# Altium schematic sheet Navigation.SchDoc
size A
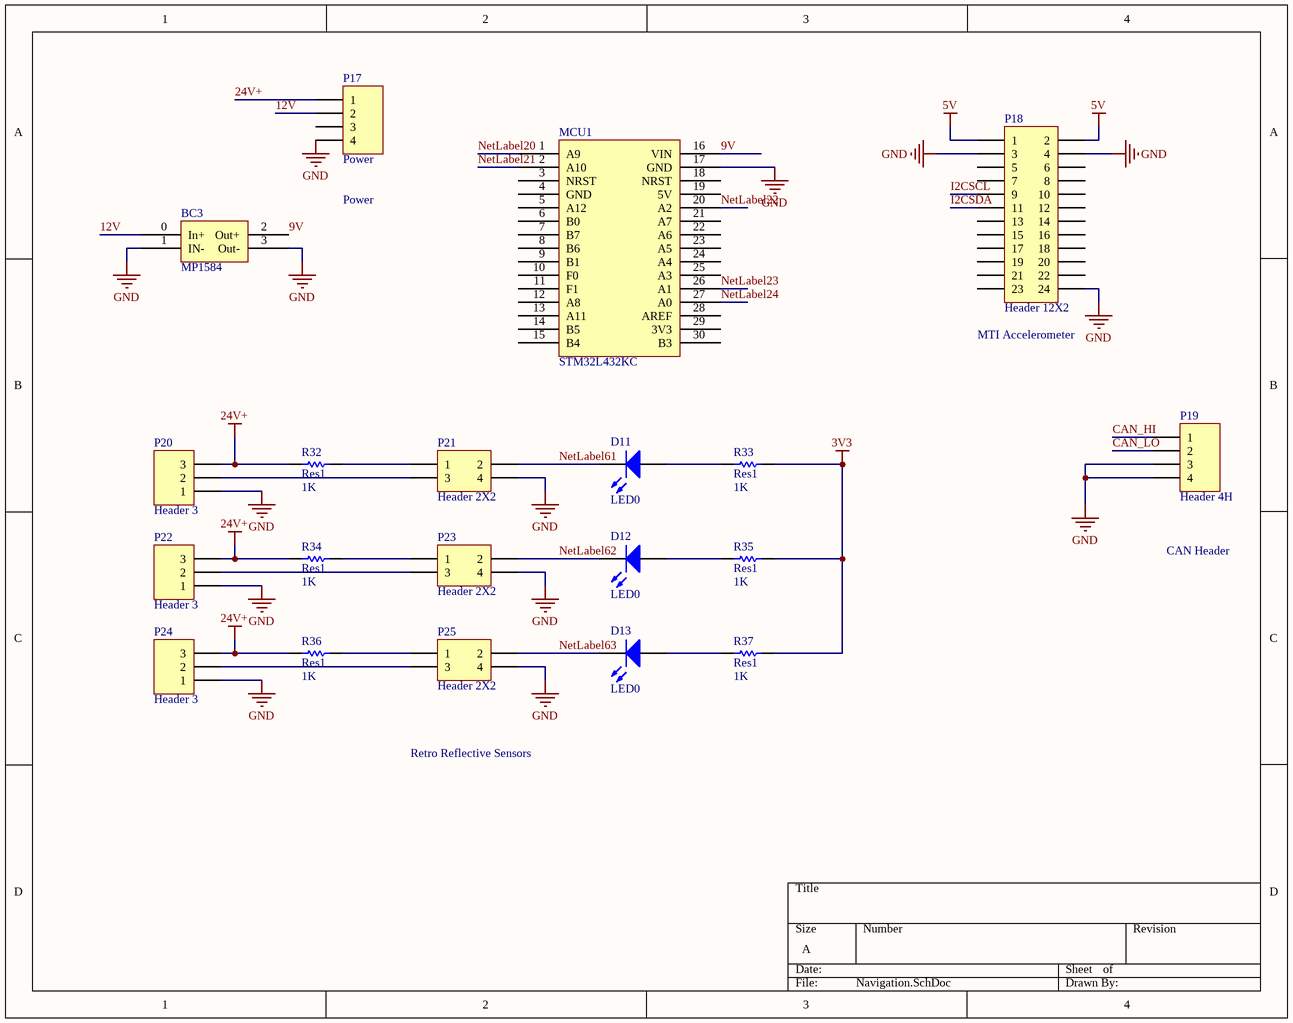
[diagram p0: Navigation.SchDoc]

## Parts
BC3  MP1584
D11  LED0  [LED-0]
D12  LED0  [LED-0]
D13  LED0  [LED-0]
MCU1  STM32L432KC
P17  Power  [HDR1X4]
P18  Header 12X2  [HDR2X12]
P19  Header 4H  [HDR1X4H]
P20  Header 3  [HDR1X3]
P21  Header 2X2  [HDR2X2]
P22  Header 3  [HDR1X3]
P23  Header 2X2  [HDR2X2]
P24  Header 3  [HDR1X3]
P25  Header 2X2  [HDR2X2]
R32  Res1  value 1K  [AXIAL-0.3]
R33  Res1  value 1K  [AXIAL-0.3]
R34  Res1  value 1K  [AXIAL-0.3]
R35  Res1  value 1K  [AXIAL-0.3]
R36  Res1  value 1K  [AXIAL-0.3]
R37  Res1  value 1K  [AXIAL-0.3]

## Nets
3V3: R33.2 R35.2 R37.2
5V: P18.1 P18.2
24V+: P17.1 P20.3 P22.3 P24.3 R32.1 R34.1 R36.1
GND: BC3.1(IN-) BC3.3(Out-) MCU1.17(GND) P17.4 P18.3 P18.4 P18.24 P19.3 P19.4 P20.1 P21.4 P22.1 P23.4 P24.1 P25.4
9V: BC3.2(Out+) MCU1.16(VIN)
12V: BC3.0(In+) P17.2
CAN_HI: P19.1
CAN_LO: P19.2
I2CSCL: P18.9
I2CSDA: P18.11
NetLabel20: MCU1.1(A9)
NetLabel21: MCU1.2(A10)
NetLabel22: MCU1.20(A2)
NetLabel23: MCU1.26(A1)
NetLabel24: MCU1.27(A0)
NetLabel61: D11.2(K) P21.2
NetLabel62: D12.2(K) P23.2
NetLabel63: D13.2(K) P25.2
NetD11_1: D11.1(A) R33.1
NetD12_1: D12.1(A) R35.1
NetD13_1: D13.1(A) R37.1
NetP20_2: P20.2 P21.3
NetP21_1: P21.1 R32.2
NetP22_2: P22.2 P23.3
NetP23_1: P23.1 R34.2
NetP24_2: P24.2 P25.3
NetP25_1: P25.1 R36.2

Not connected (* = marked no-connect by the designer): MCU1 3(NRST) 4(GND) 5(A12) 6(B0) 7(B7) 8(B6) 9(B1) 10(F0) 11(F1) 12(A8) 13(A11) 14(B5) 15(B4) 18(NRST) 19(5V) 21(A7) 22(A6) 23(A5) 24(A4) 25(A3) 28(AREF) 29(3V3) 30(B3); P17 3; P18 5 6 7 8 10 12 13 14 15 16 17 18 19 20 21 22 23

## Notes on the sheet
- Power
- (near P18) MTI Accelerometer
- CAN Header
- Retro Reflective Sensors

## Library data of the parts
D11-D13 = LED0: Typical INFRARED GaAs LED; Published: 8-Jun-2000; LatestRevisionDate: 08-Jul-2005; LatestRevisionNote: Mech Layer 1 removed.; PackageReference: LED-0; Publisher: Altium Limited; PackageDescription: LED; 2 Leads
MCU1 = STMF303K8
P17 = Header 4: Header, 4-Pin; LatestRevisionDate: 17-Jul-2002; LatestRevisionNote: Re-released for DXP Platform.; Publisher: Altium Limited
P18 = Header 12X2: Header, 12-Pin, Dual row; LatestRevisionDate: 17-Jul-2002; LatestRevisionNote: Re-released for DXP Platform.; Publisher: Altium Limited
P19 = Header 4H: Header, 4-Pin, Right Angle; LatestRevisionDate: 17-Jul-2002; LatestRevisionNote: Re-released for DXP Platform.; Publisher: Altium Limited
P20 P22 P24 = Header 3: Header, 3-Pin; LatestRevisionDate: 17-Jul-2002; LatestRevisionNote: Re-released for DXP Platform.; Publisher: Altium Limited
P21 P23 P25 = Header 2X2: Header, 2-Pin, Dual row; LatestRevisionDate: 17-Jul-2002; LatestRevisionNote: Re-released for DXP Platform.; Publisher: Altium Limited
R32-R37 = Res1: Resistor; Published: 8-Jun-2000; LatestRevisionDate: 17-Jul-2002; LatestRevisionNote: Re-released for DXP Platform.; PackageReference: AXIAL-0.3; Publisher: Altium Limited; PackageDescription: Axial Device, Thru-Hole; 2 Leads; 0.3 in Pin Spacing